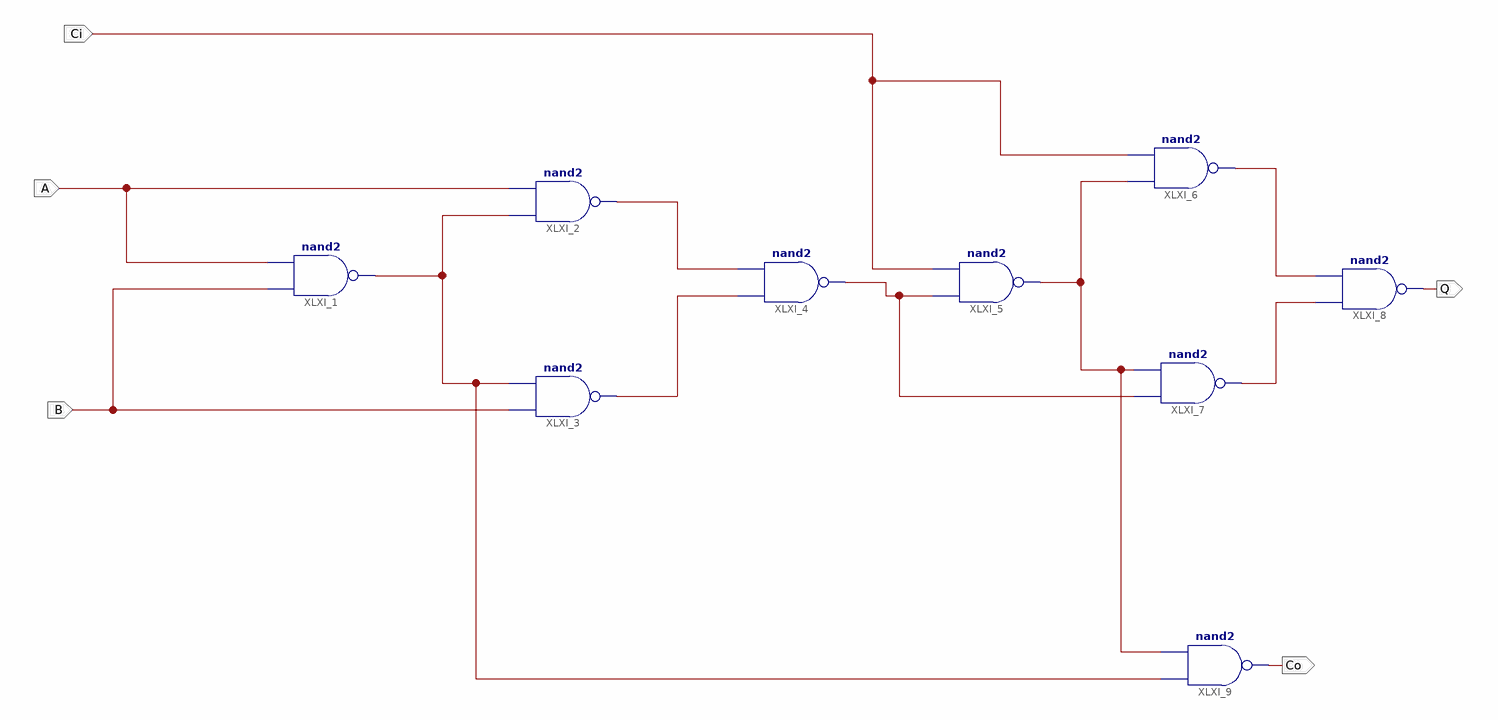
[diagram p0: schematic sheet 1]
// Xilinx ISE schematic experiment4.sch (spartan3e) as structural Verilog: 9 symbols, 5 ports
module experiment4 (
  input  A,
  input  B,
  input  Ci,
  output Co,
  output Q
);

  wire XLXN_9, XLXN_10, XLXN_14, XLXN_16, XLXN_17, XLXN_18, XLXN_19;

  nand XLXI_1 (XLXN_19, B, A);
  nand XLXI_2 (XLXN_9, XLXN_19, A);
  nand XLXI_3 (XLXN_10, B, XLXN_19);
  nand XLXI_4 (XLXN_16, XLXN_10, XLXN_9);
  nand XLXI_5 (XLXN_18, XLXN_16, Ci);
  nand XLXI_6 (XLXN_14, XLXN_18, Ci);
  nand XLXI_7 (XLXN_17, XLXN_16, XLXN_18);
  nand XLXI_8 (Q, XLXN_17, XLXN_14);
  nand XLXI_9 (Co, XLXN_19, XLXN_18);
endmodule
